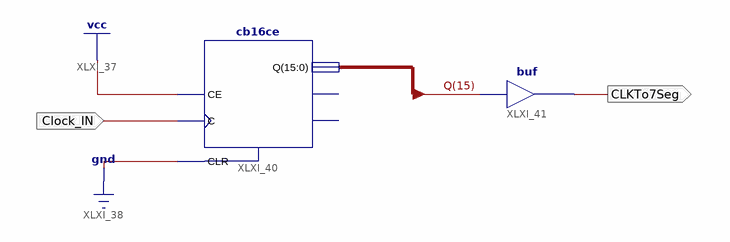
[diagram p0: schematic sheet 1]
// Xilinx ISE schematic Clock_Div.sch (spartan6) as structural Verilog: 2 symbols, 2 ports
module Clock_Div (
  input  Clock_IN,
  output CLKTo7Seg
);

  wire [15:0] Q;

  cb16ce XLXI_40 (.C(Clock_IN), .CE(1'b1), .CLR(1'b0), .Q(Q));  // open: CEO, TC
  buf XLXI_41 (CLKTo7Seg, Q[15]);
endmodule
